# EAGLE schematic main (EAGLE 9.1.0)
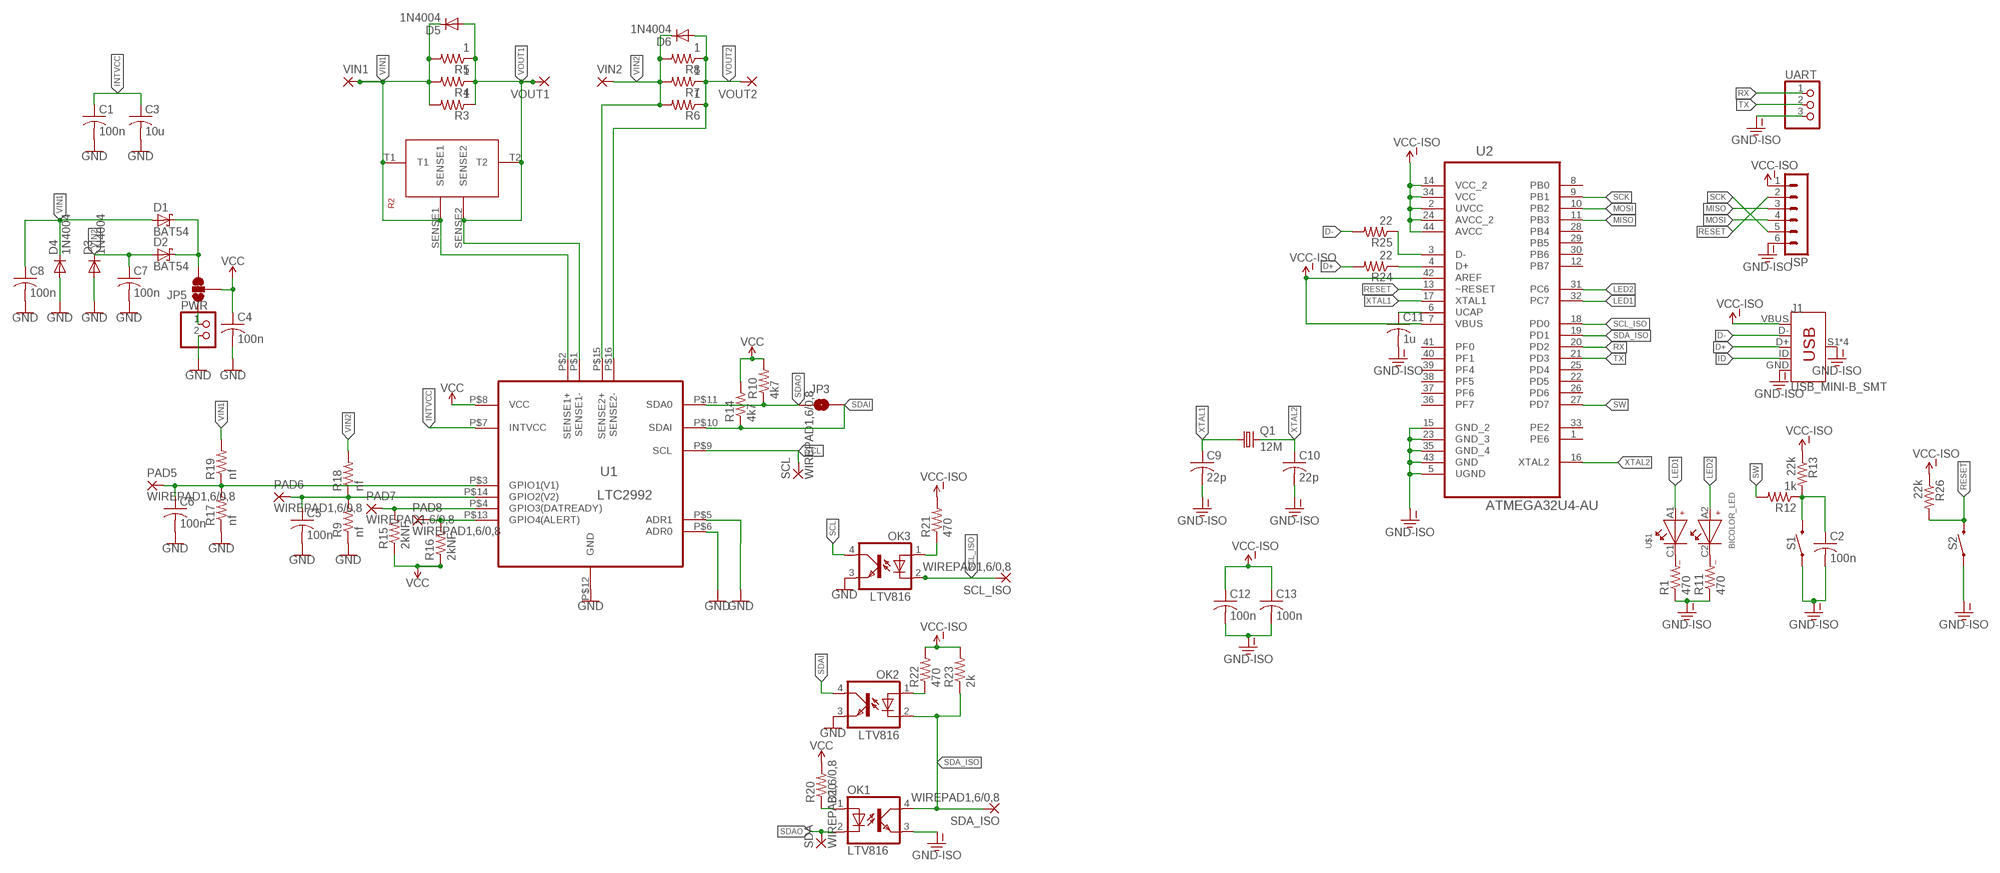
[diagram p0: schematic, sheet 1]

## Parts
C1  100n  C-USC0603  [C0603]
C2  100n  C-USC0603  [C0603]
C3  10u  C-USC0603  [C0603]
C4  100n  C-USC0603  [C0603]
C5  100n  C-USC0603  [C0603]
C6  100n  C-USC0603  [C0603]
C7  100n  C-USC0603  [C0603]
C8  100n  C-USC0603  [C0603]
C9  22p  C-USC0603  [C0603]
C10  22p  C-USC0603  [C0603]
C11  1u  C-USC0603  [C0603]
C12  100n  C-USC0603  [C0603]
C13  100n  C-USC0603  [C0603]
D1  BAT54  [SOT23]
D2  BAT54  [SOT23]
D3  1N4004  [DO41-10]
D4  1N4004  [DO41-10]
D5  1N4004  [DO41-10]
D6  1N4004  [DO41-10]
ISP  MA06-1  [MA06-1]
J1  USB_MINI-B_SMT  [USB-MINIB]
JP3  JUMPER-SMT_2_NO_SILK  [SMT-JUMPER_2_NO_SILK]
JP5  JUMPER-SMT_3_1-NC_TRACE_NO-SILK  [SMT-JUMPER_3_1-NC_TRACE_NO-SILK]
OK1  LTV816  [DIL04]
OK2  LTV816  [DIL04]
OK3  LTV816  [DIL04]
PAD5  WIREPAD1,6/0,8  [1,6/0,8]
PAD6  WIREPAD1,6/0,8  [1,6/0,8]
PAD7  WIREPAD1,6/0,8  [1,6/0,8]
PAD8  WIREPAD1,6/0,8  [1,6/0,8]
PWR  PINHD-1X2  [1X02]
Q1  12M  CRYSTALHC49S  [HC49/S]
R1  470  R-US_R0603  [R0603]
R2  30m  CSR2TTE30L0F  [CSR2TTE30L0F]
R3  1  R-US_0309/12  [0309/12]
R4  1  R-US_M1206  [M1206]
R5  1  R-US_R0603  [R0603]
R6  1  R-US_0309/12  [0309/12]
R7  1  R-US_M1206  [M1206]
R8  1  R-US_R0603  [R0603]
R9  nf  R-US_R0603  [R0603]
R10  4k7  R-US_R0603  [R0603]
R11  470  R-US_R0603  [R0603]
R12  1k  R-US_R0603  [R0603]
R13  22k  R-US_R0603  [R0603]
R14  4k7  R-US_R0603  [R0603]
R15  2kNF  R-US_R0603  [R0603]
R16  2kNF  R-US_R0603  [R0603]
R17  nf  R-US_R0603  [R0603]
R18  nf  R-US_R0603  [R0603]
R19  nf  R-US_R0603  [R0603]
R20  820  R-US_R0603  [R0603]
R21  470  R-US_R0603  [R0603]
R22  470  R-US_R0603  [R0603]
R23  2k  R-US_R0603  [R0603]
R24  22  R-US_R0603  [R0603]
R25  22  R-US_R0603  [R0603]
R26  22k  R-US_R0603  [R0603]
S1  MOMENTARY-SWITCH-SPST-PTH-6.0MM-KIT  [TACTILE_SWITCH_PTH_6.0MM_KIT]
S2  MOMENTARY-SWITCH-SPST-PTH-6.0MM-KIT  [TACTILE_SWITCH_PTH_6.0MM_KIT]
SCL  WIREPAD1,6/0,8  [1,6/0,8]
SCL_ISO  WIREPAD1,6/0,8  [1,6/0,8]
SDA  WIREPAD1,6/0,8  [1,6/0,8]
SDA_ISO  WIREPAD1,6/0,8  [1,6/0,8]
U1  LTC2992  [MSOP_16]
U2  ATMEGA32U4-AU  [QFP80P1200X1200X120-44N]
U$1  BICOLOR_LED  [BICOLOR_LED]
UART  PINHD-1X3  [1X03]
VIN1  2,54/0,8  [2,54/0,8]
VIN2  2,54/0,8  [2,54/0,8]
VOUT1  2,54/0,8  [2,54/0,8]
VOUT2  2,54/0,8  [2,54/0,8]

## Nets
D+: J1.D+ R24.2
D-: J1.D- R25.2
GND: C1.2 C3.2 C4.2 C5.2 C6.2 C7.2 C8.2 D3.A D4.A OK2.3(EMIT) OK3.3(EMIT) PWR.2 R9.1 R17.1 U1.P$5(ADR1) U1.P$6(ADR0) U1.P$12(GND)
GND-ISO: C2.2 C9.2 C10.2 C11.2 C12.2 C13.2 ISP.6 J1.GND J1.S1(SHIELD) J1.S2(SHIELD) J1.S3(SHIELD) J1.S4(SHIELD) OK1.3(EMIT) R1.1 R11.1 S1.1 S2.1 U2.5(UGND) U2.15(GND_2) U2.23(GND_3) U2.35(GND_4) U2.43(GND) UART.3
ID: J1.ID
INTVCC: C1.1 C3.1 U1.P$7(INTVCC)
LED1: U2.32(PC7) U$1.A1
LED2: U2.31(PC6) U$1.A2
MISO: ISP.3 U2.11(PB3)
MOSI: ISP.4 U2.10(PB2)
N$1: R1.2 U$1.C1
N$2: R11.2 U$1.C2
N$4: C2.1 R12.1 R13.2 S1.3
N$5: OK1.1(A) R20.1
N$8: C6.1 PAD5.1(P) R17.2 R19.1 U1.P$3(GPIO1(V1))
N$11: C5.1 PAD6.1(P) R9.2 R18.1 U1.P$14(GPIO2(V2))
N$12: PAD7.1(P) R15.2 U1.P$4(GPIO3(DATREADY))
N$13: PAD8.1(P) R16.2 U1.P$13(GPIO4(ALERT))
N$14: JP5.1 PWR.1
N$15: D1.3(C) D2.3(C) JP5.3
N$16: OK3.1(A) R21.1
N$17: C11.1 U2.6(UCAP)
N$18: OK2.1(A) R22.1
N$20: R25.1 U2.3(D-)
N$21: R24.1 U2.4(D+)
RESET: ISP.2 R26.2 S2.3 U2.13(~RESET)
RX: U2.20(PD2) UART.1
SCK: ISP.5 U2.9(PB1)
SCL: OK3.4(COL) SCL.1(P) U1.P$9(SCL)
SCL_ISO: OK3.2(C) SCL_ISO.1(P) U2.18(PD0)
SDA_ISO: OK1.4(COL) OK2.2(C) R23.1 SDA_ISO.1(P) U2.19(PD1)
SDAI: JP3.2 OK2.4(COL) R14.1 U1.P$10(SDAI)
SDAO: JP3.1 OK1.2(C) R10.1 SDA.1(P) U1.P$11(SDA0)
SW: R12.2 U2.27(PD7)
TX: U2.21(PD3) UART.2
VCC: C4.1 JP5.2 R10.2 R14.2 R15.1 R16.1 R20.2 U1.P$8(VCC)
VCC-ISO: C12.1 C13.1 ISP.1 J1.VBUS R13.1 R21.2 R22.2 R23.2 R26.1 U2.2(UVCC) U2.7(VBUS) U2.14(VCC_2) U2.24(AVCC_2) U2.34(VCC) U2.42(AREF) U2.44(AVCC)
VIN1: C8.1 D1.1(A) D4.C D5.C R2.SENSE1 R2.T1 R3.2 R4.2 R5.2 R19.2 U1.P$2(SENSE1+) VIN1.1(P)
VIN2: C7.1 D2.1(A) D3.C D6.C R6.2 R7.2 R8.2 R18.2 U1.P$15(SENSE2+) VIN2.1(P)
VOUT1: D5.A R2.SENSE2 R2.T2 R3.1 R4.1 R5.1 U1.P$1(SENSE1-) VOUT1.1(P)
VOUT2: D6.A R6.1 R7.1 R8.1 U1.P$16(SENSE2-) VOUT2.1(P)
XTAL1: C9.1 Q1.1 U2.17(XTAL1)
XTAL2: C10.1 Q1.2 U2.16(XTAL2)
Unconnected: U2.1(PE6) U2.8(PB0) U2.12(PB7) U2.22(PD5) U2.25(PD4) U2.26(PD6) U2.28(PB4) U2.29(PB5) U2.30(PB6) U2.33(PE2) U2.36(PF7) U2.37(PF6) U2.38(PF5) U2.39(PF4) U2.40(PF1) U2.41(PF0)

## Library data of the parts
C1-C13 = rcl:C-US: CAPACITOR, American symbol; SPICEPREFIX: C
D1 D2 = diode:BAT54: Schottky Diodes Source: Fairchild .. BAT54.pdf
D3-D6 = diode:1N4004: DIODE general purpose rectifier, 1 A
ISP = con-lstb:MA06-1: PIN HEADER; OC_FARNELL: unknown; OC_NEWARK: unknown
J1 = SparkFun-Connectors:USB_MINI-B: USB type Mini-B Connector Breaks out 5th pin, and includes shield pins if needed. SparkFun Products: SparkFun FTDI Basic Breakout <https://www.sparkfun.com/products/9716> SparkFun XBee Explorer USB <https://www.sparkfun.com/products/11812> SparkFun Redboard <https://www.sparkfun.com/products/12757>; PROD_ID: CONN-08193; SF_ID: PRT-00587
JP3 = SparkFun-Jumpers:JUMPER-SMT_2_NO: Normally open jumper This jumper has two pads in close proximity to each other. Apply solder to close the connection. Round pads are easier to solder for beginners, but are a lot larger. SparkFun Product that uses the round pads: SparkFun EL Sequencer <https://www.sparkfun.com/products/12781>
JP5 = SparkFun-Jumpers:JUMPER-SMT_3_1-NC_TRACE: Normally closed trace jumper (1 of 2 connections) This jumper has a trace between two pads so it's normally closed (NC). The other connection is normally open (NO). Use a razor knife to open the connection. For best results follow the IPC guidelines for cutting traces: Cutout at least 0.063 mm (0.005 in). Remove all loose material to clean up the cut area. Seal the cut with an approved epoxy. Reapply solder to reclose the connection, or to close the NO connection.
OK1-OK3 = optocoupler:LTV816: OPTO COUPLER Source: LITEON, LTV816.pdf; OC_FARNELL: unknown; OC_NEWARK: unknown
PAD5-PAD8 SCL SCL_ISO SDA SDA_ISO = wirepad:WIREPAD: Wire PAD connect wire on PCB
PWR = pinhead:PINHD-1X2: PIN HEADER
Q1 = crystal:CRYSTAL: CRYSTAL; OC_FARNELL: 1667008; OC_NEWARK: unknown
R1 R3-R26 = rcl:R-US_: RESISTOR, American symbol; SPICEPREFIX: R
R2 = 7_segment_lib:CSR2TTE30L0F
S1 S2 = SparkFun-Switches:MOMENTARY-SWITCH-SPST: Momentary Switch (Pushbutton) - SPST Normally-open (NO) SPST momentary switches (buttons, pushbuttons). Variants PTH-12MM - 12mm square, through-hole Momentary Pushbutton Switch - 12mm Square <https://www.sparkfun.com/products/9190> (COM-09190) PTH-6.0MM, PTH-6.0MM-KIT - 6.0mm square, through-hole Mini Pushbutton Switch <https://www.sparkfun.com/products/97> (COM-00097) KIT package intended for soldering kit's - only one side of pads' copper is exposed. PTH-RIGHT-ANGLE-KIT - Right-angle, through-hole Right Angle Tactile Button <https://www.sparkfun.com/products/10791> - Used on SparkFun BigTime Watch Kit <https://www.sparkfun.com/products/11734> SMD-12MM - 12mm square, surface-mount Tactile Button - SMD (12mm) <https://www.sparkfun.com/products/12993> (COM-12993) Used on SparkFun PicoBoard <https://www.sparkfun.com/products/11888> SMD-4.5MM - 4.5mm Square Trackball Switch Used on SparkFun Blackberry Trackballer Breakout <https://www.sparkfun.com/products/13169> SMD-4.6MMX2.8MM - 4.60mm x 2.80mm, surface mount Used on SparkFun SAMD21 Mini Breakout <https://www.sparkfun.com/products/13664> SMD-5.2MM, SMD-5.2-REDUNDANT - 5.2mm square, surface-mount Mini Pushbutton Switch - SMD <https://www.sparkfun.com/products/8720> (COM-08720) Used on Arduino Pro Mini <https://www.sparkfun.com/products/11114> REDUNDANT package connects both switch circuits together SMD-6.0X3.5MM - 6.0 x 3.5mm, surface mount Momentary Reset Switch SMD <https://www.sparkfun.com/products/8229> (COM-08229) SMD-6.2MM-TALL - 6.2mm square, surface mount Tactile Button - SMD (6mm) <https://www.sparkfun.com/products/12992> Used on SparkFun Digital Sandbox <https://www.sparkfun.com/products/12651> SMD-RIGHT-ANGLE - Right-angle, surface mount Used on SparkFun Block for Intel® Edison - Arduino <https://www.sparkfun.com/products/13036>; PROD_ID: SWCH-08441; SF_SKU: COM-00097
U1 = 7_segment_lib:LTC2992: Voltage and Current Monitor
U2 = Atmel_By_element14_Batch_1-00:ATMEGA32U4-AU: 8-bit Microcontroller with ISP Flash and USB Controller; MPN: ATMEGA32U4-AU; OC_FARNELL: 1748525; OC_NEWARK: 26R5633; PACKAGE: TQFP-44; SUPPLIER: Atmel
U$1 = 7_segment_lib:BICOLOR_LED
UART = pinhead:PINHD-1X3: PIN HEADER
VIN1 VIN2 VOUT1 VOUT2 = wirepad:2,54/0,8: THROUGH-HOLE PAD